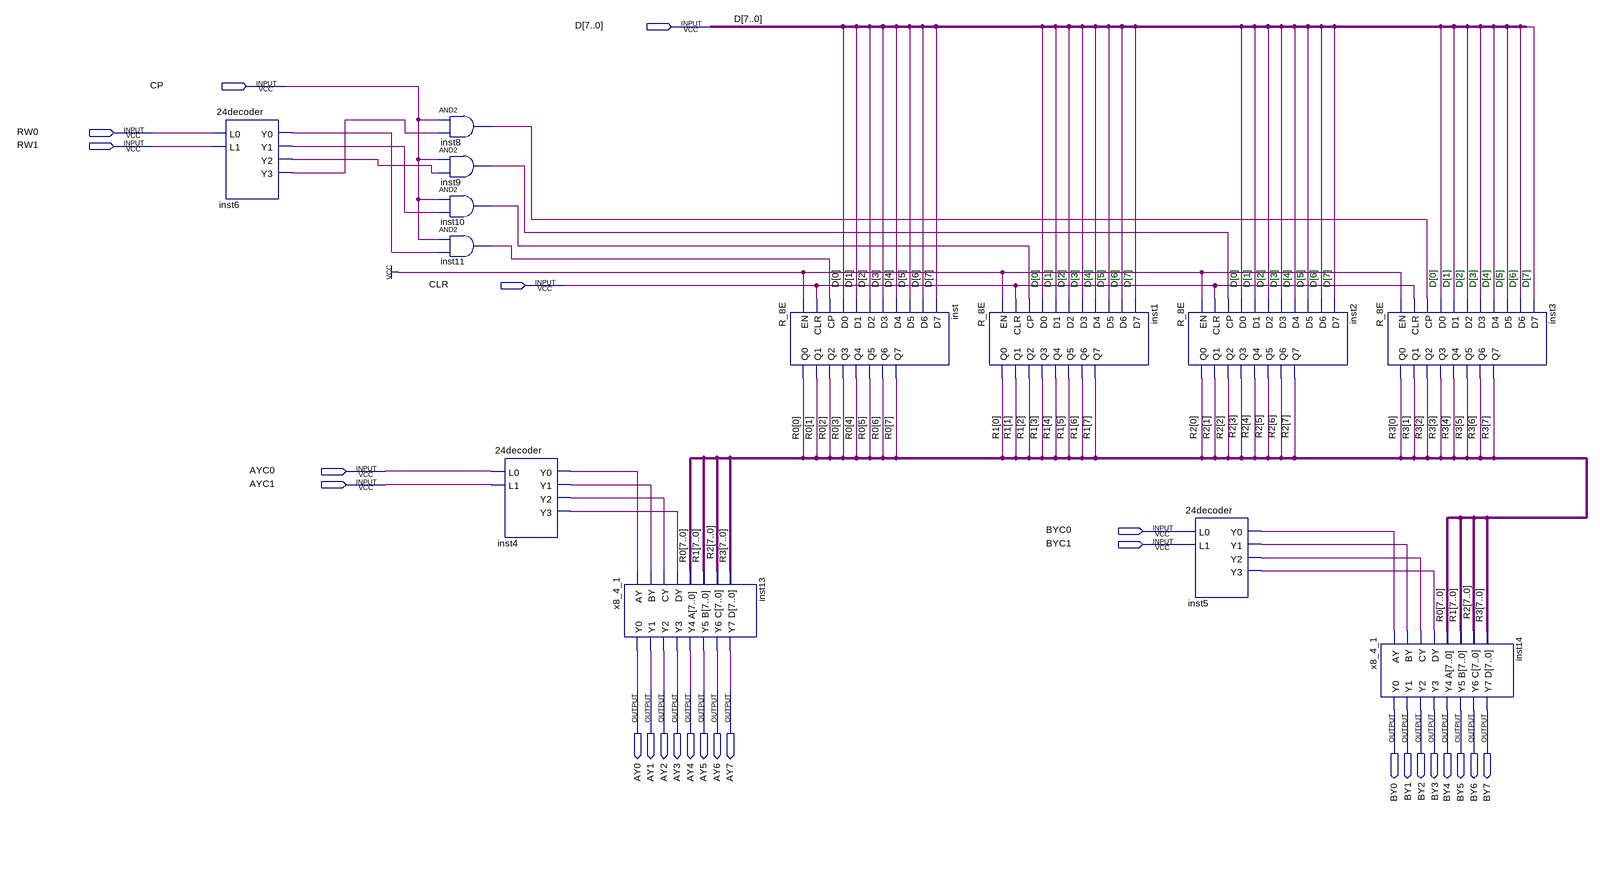
[diagram p0: schematic sheet]
// Quartus schematic R0-R4.bdf as structural Verilog: 13 symbols, 25 pins
module \R0-R4  (
  input  [7:0] D,
  input  CP,
  input  RW0,
  input  RW1,
  input  CLR,
  input  AYC0,
  input  AYC1,
  input  BYC0,
  input  BYC1,
  output AY0,
  output AY1,
  output AY2,
  output AY3,
  output AY4,
  output AY5,
  output AY6,
  output AY7,
  output BY0,
  output BY1,
  output BY2,
  output BY3,
  output BY4,
  output BY5,
  output BY6,
  output BY7
);

  wire inst4_y0, inst4_y1, inst4_y2, inst4_y3, inst5_y0, inst5_y1, inst5_y2, inst5_y3, inst6_y0, inst6_y1,
       inst6_y2, inst6_y3, inst8_out, inst9_out, inst10_out, inst11_out;
  wire [7:0] R0, R1, R2, R3;

  \24decoder  inst6 (.L0(RW0), .L1(RW1), .Y0(inst6_y0), .Y1(inst6_y1), .Y2(inst6_y2), .Y3(inst6_y3));
  and inst8 (inst8_out, CP, inst6_y3);
  and inst9 (inst9_out, CP, inst6_y2);
  and inst10 (inst10_out, CP, inst6_y1);
  and inst11 (inst11_out, CP, inst6_y0);
  \24decoder  inst4 (.L0(AYC0), .L1(AYC1), .Y0(inst4_y0), .Y1(inst4_y1), .Y2(inst4_y2), .Y3(inst4_y3));
  x8_4_1 inst13 (
    .AY(inst4_y0), .BY(inst4_y1), .CY(inst4_y2), .DY(inst4_y3), .A(R0), .B(R1), .C(R2), .D(R3), .Y0(AY0),
    .Y1(AY1), .Y2(AY2), .Y3(AY3), .Y4(AY4), .Y5(AY5), .Y6(AY6), .Y7(AY7));
  R_8E inst (
    .EN(1'b1), .CLR(CLR), .CP(inst11_out), .D0(D[0]), .D1(D[1]), .D2(D[2]), .D3(D[3]), .D4(D[4]), .D5(D[5]),
    .D6(D[6]), .D7(D[7]), .Q0(R0[0]), .Q1(R0[1]), .Q2(R0[2]), .Q3(R0[3]), .Q4(R0[4]), .Q5(R0[5]), .Q6(R0[6]),
    .Q7(R0[7]));
  R_8E inst1 (
    .EN(1'b1), .CLR(CLR), .CP(inst10_out), .D0(D[0]), .D1(D[1]), .D2(D[2]), .D3(D[3]), .D4(D[4]), .D5(D[5]),
    .D6(D[6]), .D7(D[7]), .Q0(R1[0]), .Q1(R1[1]), .Q2(R1[2]), .Q3(R1[3]), .Q4(R1[4]), .Q5(R1[5]), .Q6(R1[6]),
    .Q7(R1[7]));
  R_8E inst2 (
    .EN(1'b1), .CLR(CLR), .CP(inst9_out), .D0(D[0]), .D1(D[1]), .D2(D[2]), .D3(D[3]), .D4(D[4]), .D5(D[5]),
    .D6(D[6]), .D7(D[7]), .Q0(R2[0]), .Q1(R2[1]), .Q2(R2[2]), .Q3(R2[3]), .Q4(R2[4]), .Q5(R2[5]), .Q6(R2[6]),
    .Q7(R2[7]));
  \24decoder  inst5 (.L0(BYC0), .L1(BYC1), .Y0(inst5_y0), .Y1(inst5_y1), .Y2(inst5_y2), .Y3(inst5_y3));
  x8_4_1 inst14 (
    .AY(inst5_y0), .BY(inst5_y1), .CY(inst5_y2), .DY(inst5_y3), .A(R0), .B(R1), .C(R2), .D(R3), .Y0(BY0),
    .Y1(BY1), .Y2(BY2), .Y3(BY3), .Y4(BY4), .Y5(BY5), .Y6(BY6), .Y7(BY7));
  R_8E inst3 (
    .EN(1'b1), .CLR(CLR), .CP(inst8_out), .D0(D[0]), .D1(D[1]), .D2(D[2]), .D3(D[3]), .D4(D[4]), .D5(D[5]),
    .D6(D[6]), .D7(D[7]), .Q0(R3[0]), .Q1(R3[1]), .Q2(R3[2]), .Q3(R3[3]), .Q4(R3[4]), .Q5(R3[5]), .Q6(R3[6]),
    .Q7(R3[7]));

  // Notes on the sheet:
  //   D[0]
  //   D[1]
  //   D[2]
  //   D[3]
  //   D[4]
  //   D[5]
  //   D[6]
  //   D[7]
  //   D[0]
  //   D[1]
  //   D[2]
  //   D[3]
  //   D[4]
  //   D[5]
  //   D[6]
  //   D[7]
  //   D[0]
  //   D[1]
  //   D[2]
  //   D[3]
  //   D[4]
  //   D[5]
  //   D[6]
  //   D[7]
endmodule
